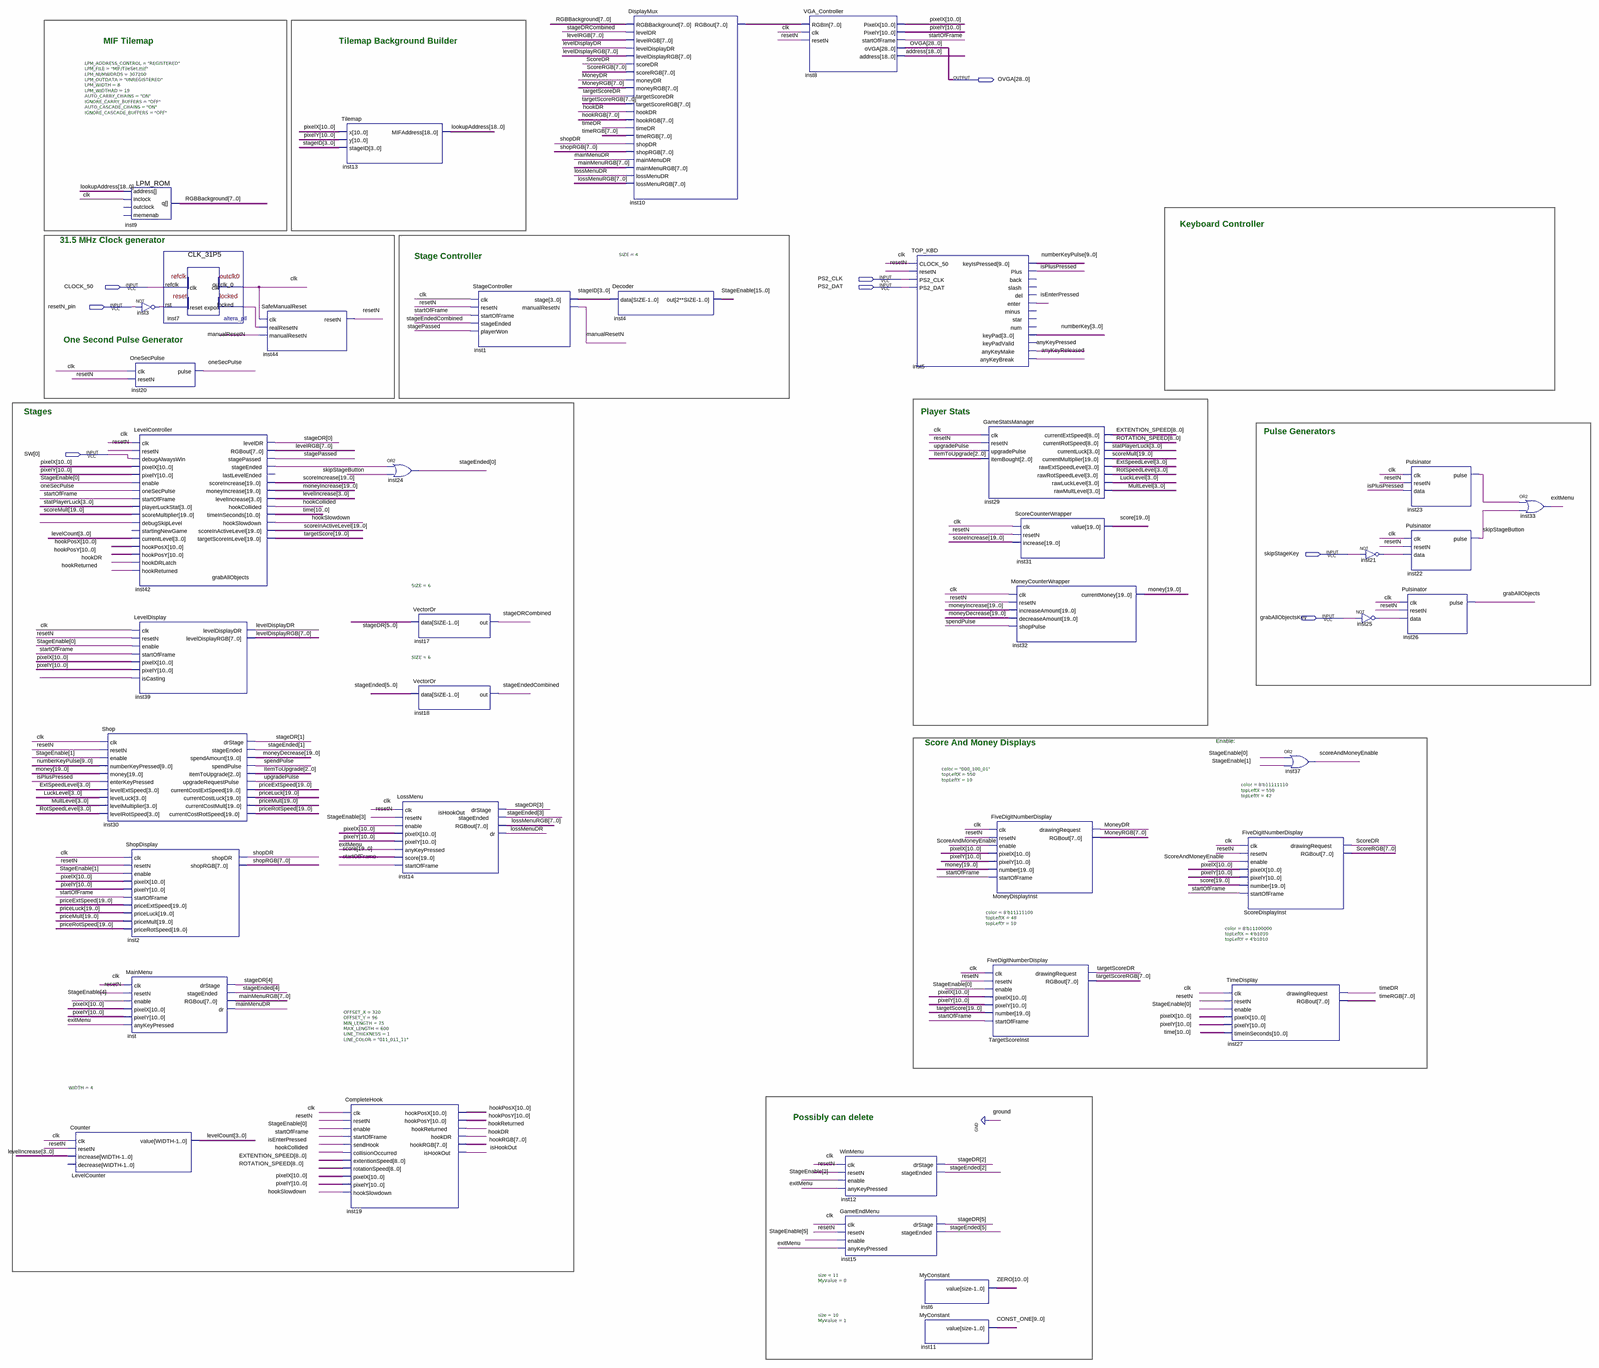
[diagram p0: schematic sheet, whole]
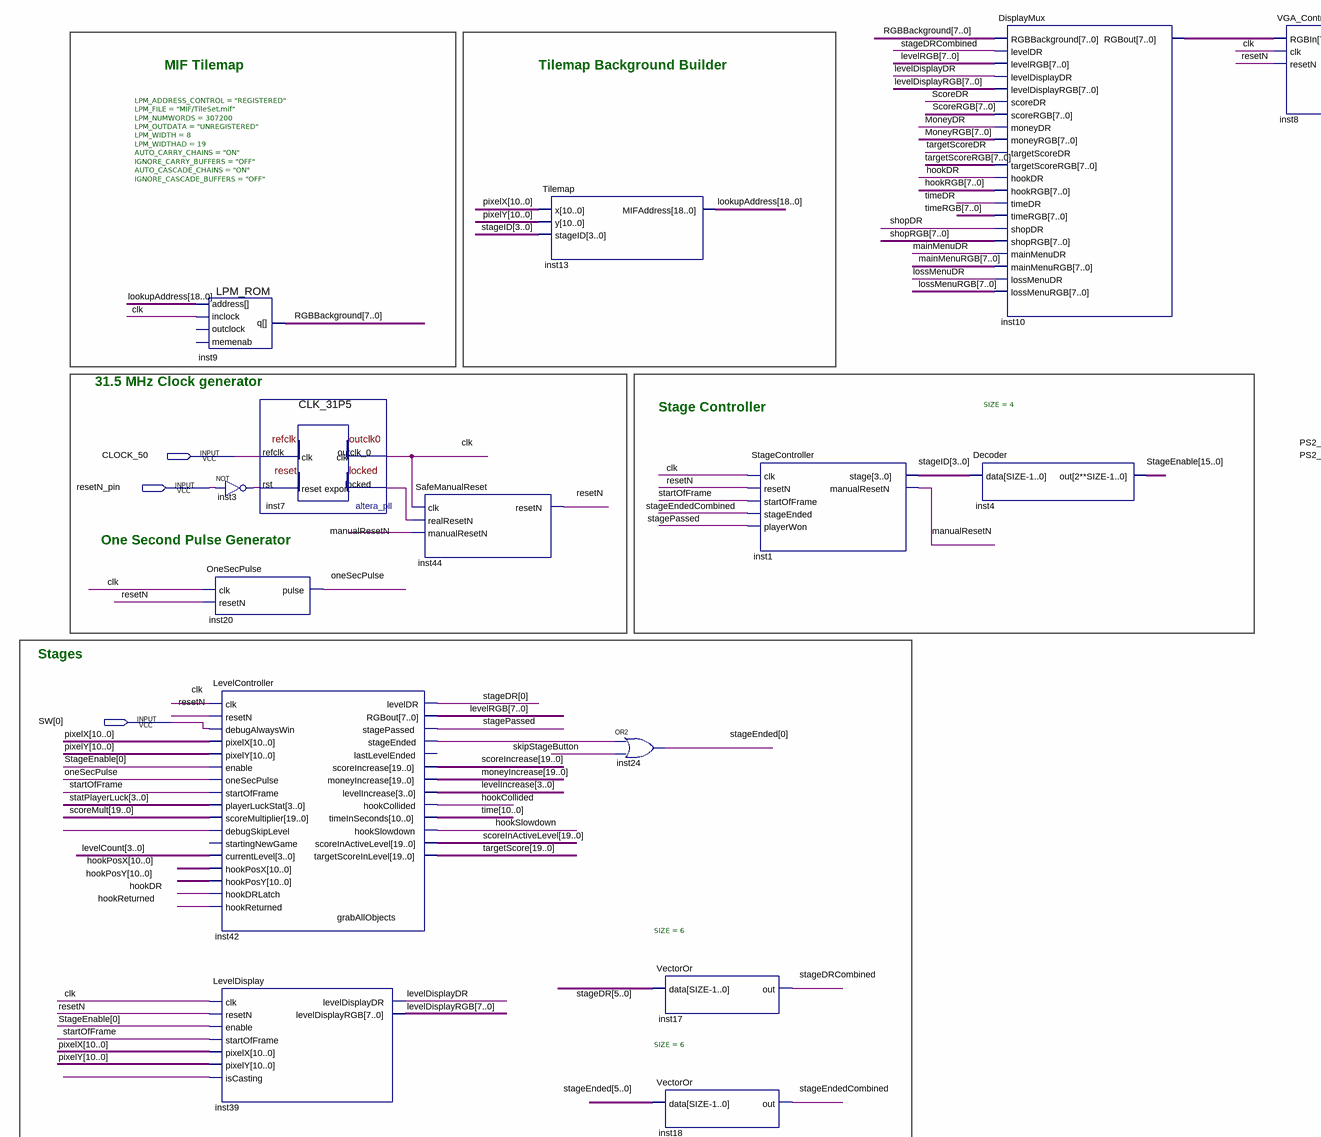
[diagram p1: schematic sheet, upper left part]
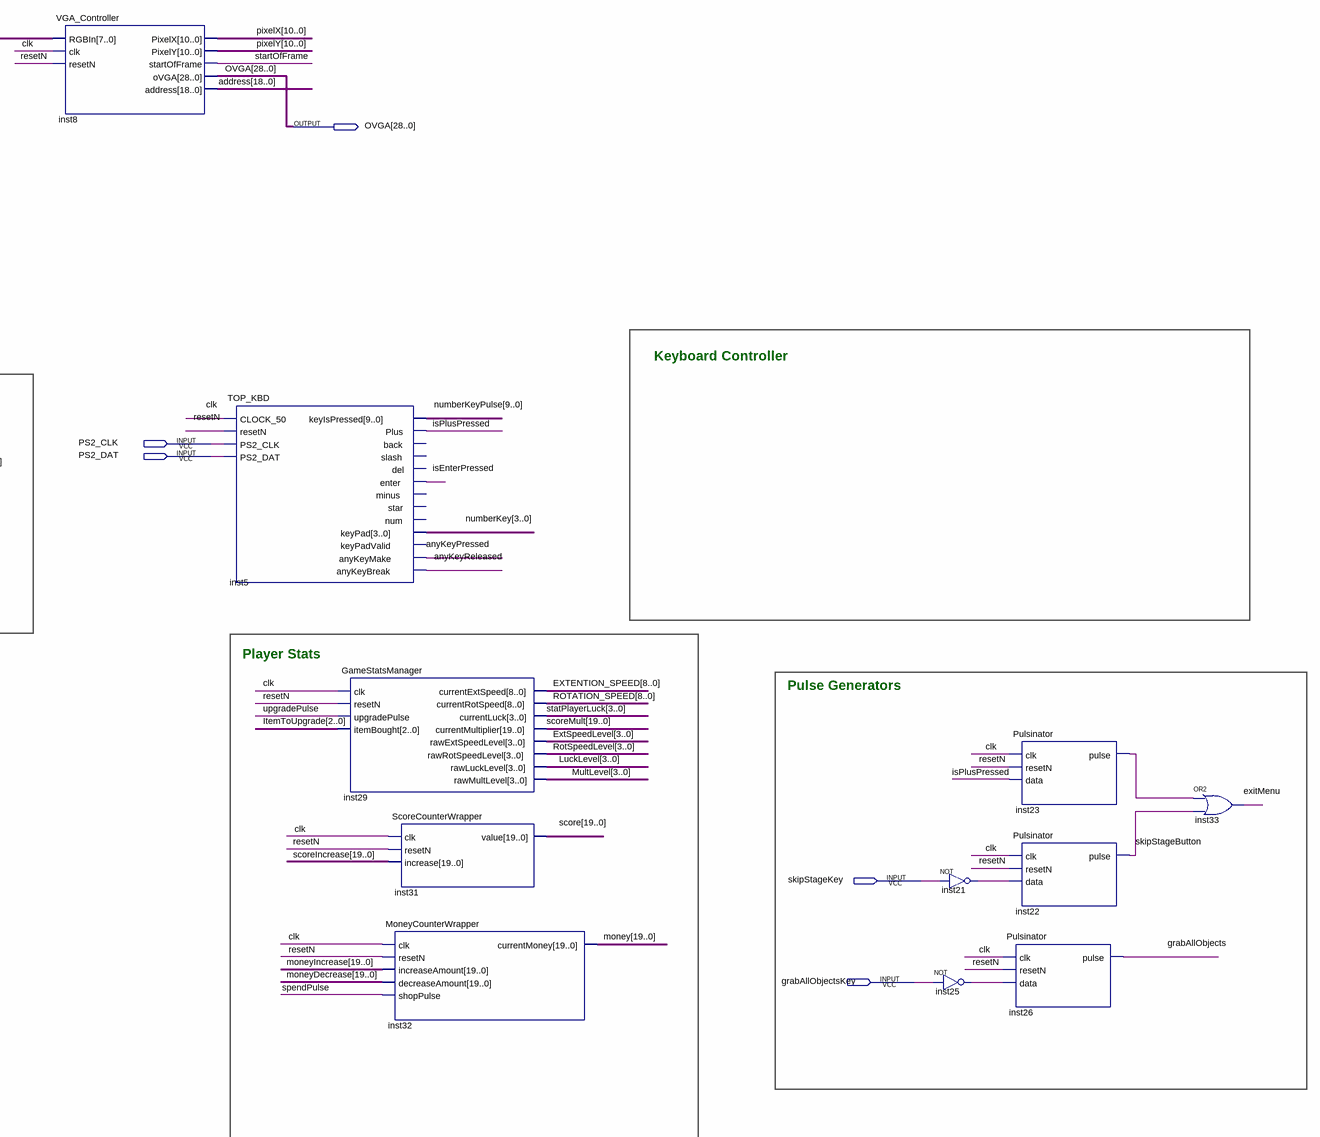
[diagram p2: schematic sheet, upper right part]
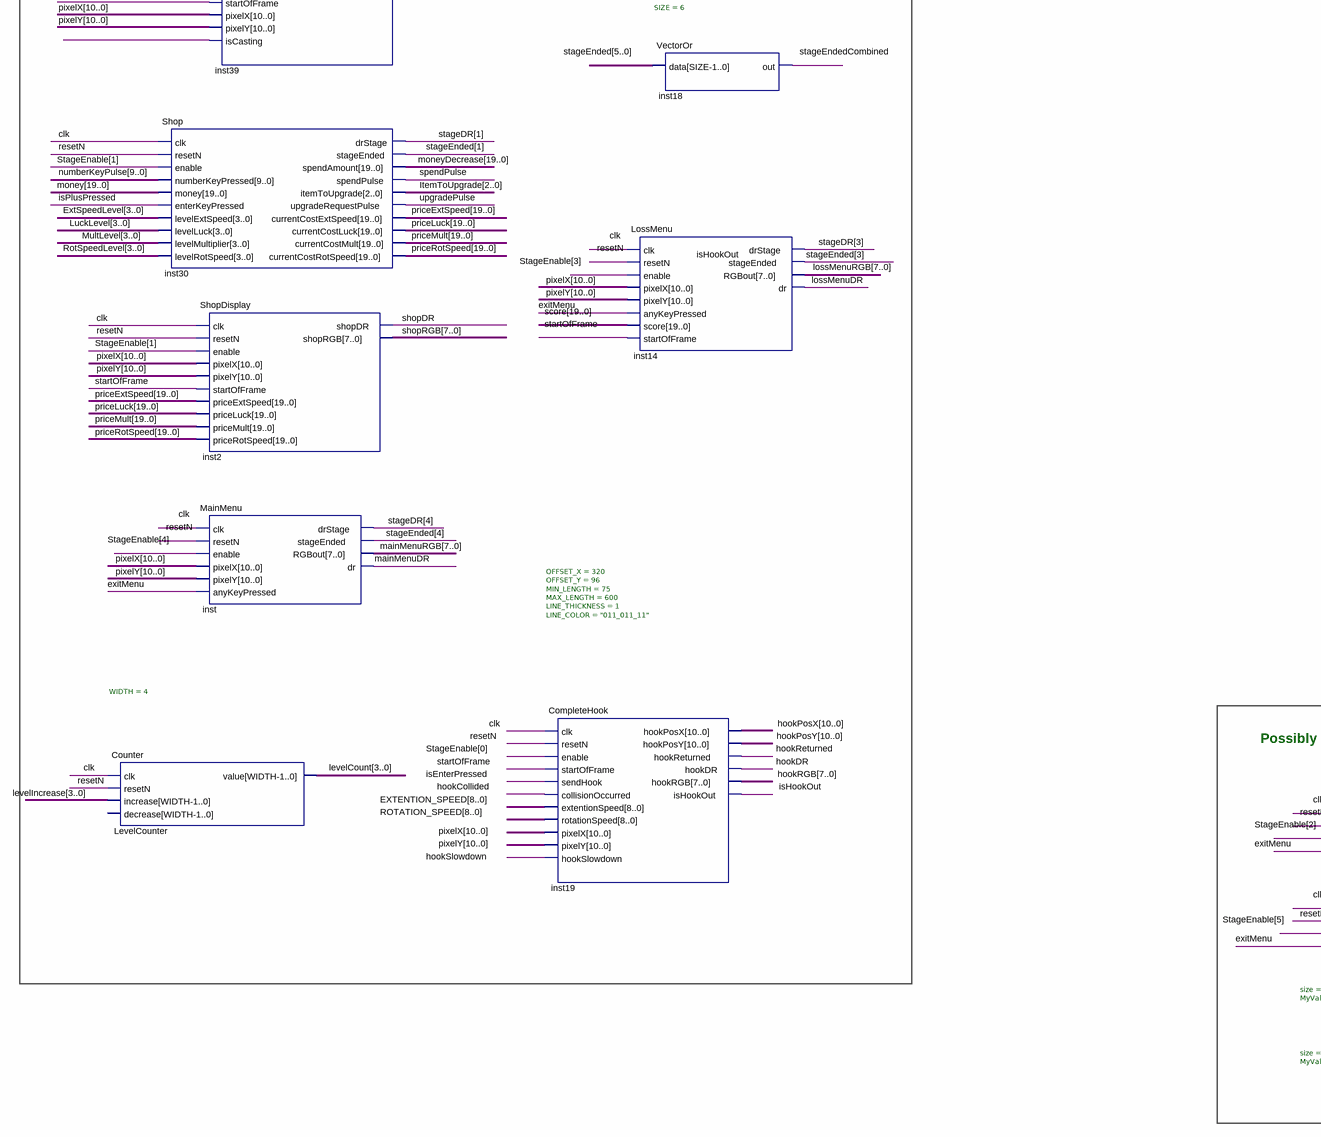
[diagram p3: schematic sheet, lower left part]
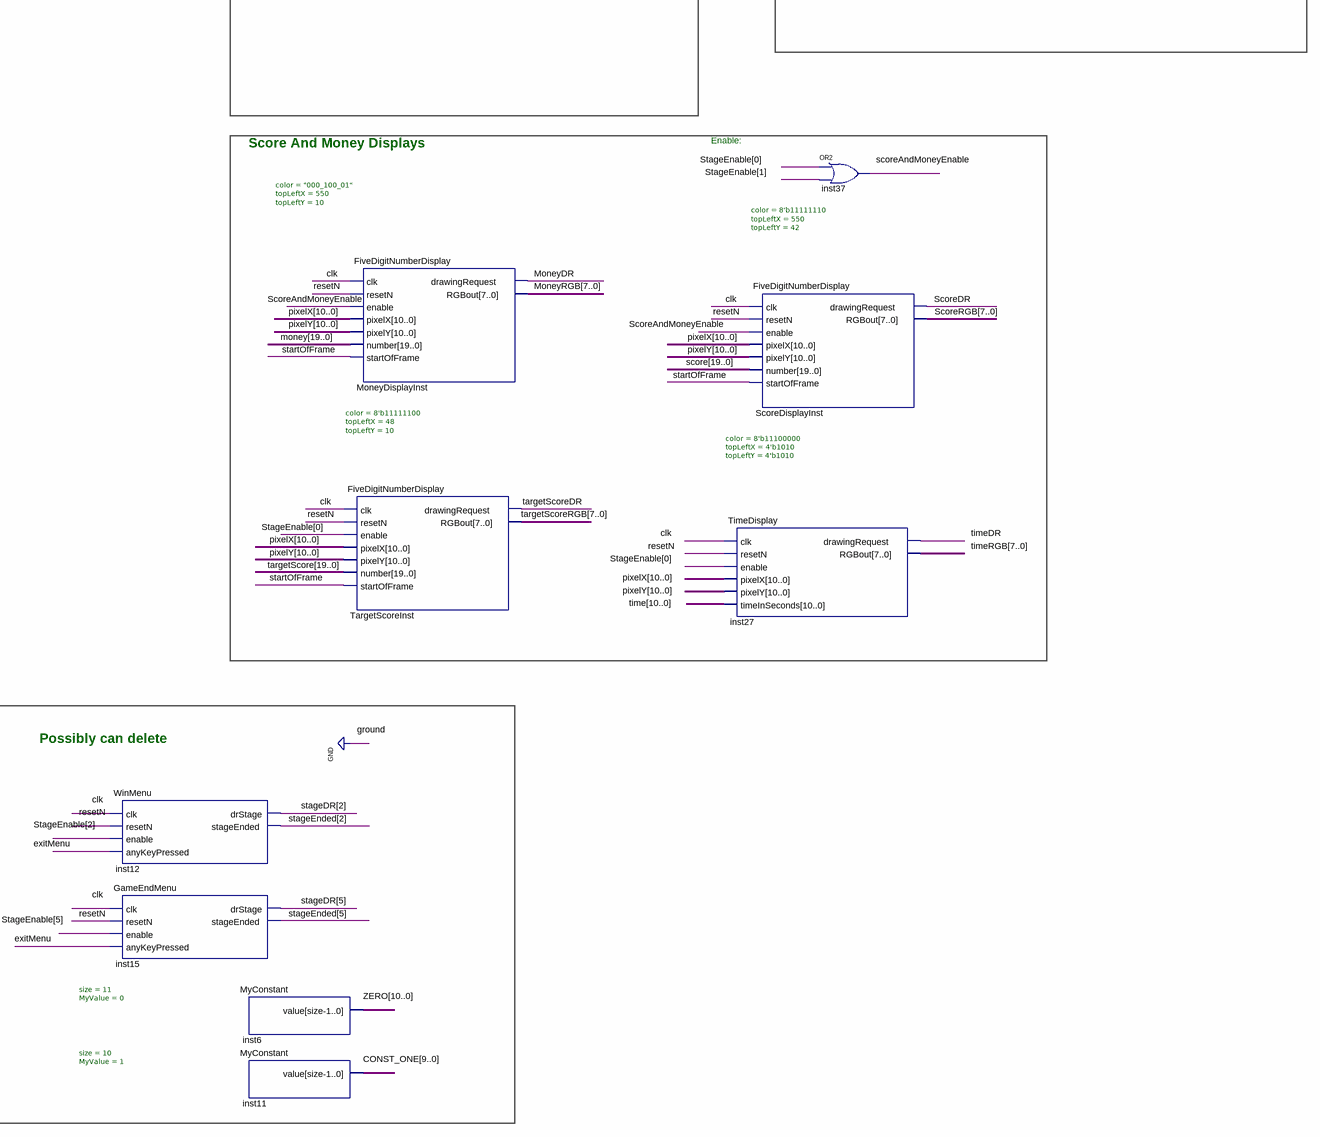
[diagram p4: schematic sheet, lower right part]
// Quartus schematic main.bdf as structural Verilog: 40 symbols, 8 pins
module main (
  input  PS2_CLK,
  input  CLOCK_50,
  input  PS2_DAT,
  input  resetN_pin,
  input  [0:0] SW,
  input  skipStageKey,
  input  grabAllObjectsKey,
  output [28:0] OVGA
);

  wire anyKeyPressed, anyKeyReleased, clk, exitMenu, grabAllObjects, hookCollided, hookDR, hookReturned,
       hookSlowdown, inst3_out, inst7_locked, inst21_out, inst23_pulse, inst25_out, inst42_stageended,
       isEnterPressed, isHookOut, isPlusPressed, levelDisplayDR, lossMenuDR, mainMenuDR, manualResetN,
       MoneyDR, oneSecPulse, resetN, ScoreAndMoneyEnable, ScoreDR, shopDR, skipStageButton, spendPulse,
       stageDRCombined, stageEndedCombined, stagePassed, startOfFrame, targetScoreDR, timeDR, upgradePulse;
  wire [2:0] ItemToUpgrade;
  wire [3:0] ExtSpeedLevel, levelCount, levelIncrease, LuckLevel, MultLevel, numberKey, RotSpeedLevel,
       stageID, statPlayerLuck;
  wire [5:0] stageDR, stageEnded;
  wire [7:0] hookRGB, inst10_rgbout, levelDisplayRGB, levelRGB, lossMenuRGB, mainMenuRGB, MoneyRGB,
       RGBBackground, ScoreRGB, shopRGB, targetScoreRGB, timeRGB;
  wire [8:0] EXTENTION_SPEED, ROTATION_SPEED;
  wire [9:0] CONST_ONE, numberKeyPulse;
  wire [10:0] hookPosX, hookPosY, pixelX, pixelY, \time , ZERO;
  wire [15:0] StageEnable;
  wire [18:0] address, lookupAddress;
  wire [19:0] money, moneyDecrease, moneyIncrease, priceExtSpeed, priceLuck, priceMult, priceRotSpeed, score,
       scoreInActiveLevel, scoreIncrease, scoreMult, targetScore;

  Counter #(.WIDTH(4)) LevelCounter (
    .clk(clk), .resetN(resetN), .increase(levelIncrease), .value(levelCount));  // open: decrease
  Shop inst30 (
    .clk(clk), .resetN(resetN), .enable(StageEnable[1]), .numberKeyPressed(numberKeyPulse), .money(money),
    .enterKeyPressed(isPlusPressed), .levelExtSpeed(ExtSpeedLevel), .levelLuck(LuckLevel),
    .levelMultiplier(MultLevel), .levelRotSpeed(RotSpeedLevel), .drStage(stageDR[1]),
    .stageEnded(stageEnded[1]), .spendAmount(moneyDecrease), .spendPulse(spendPulse),
    .itemToUpgrade(ItemToUpgrade), .upgradeRequestPulse(upgradePulse), .currentCostExtSpeed(priceExtSpeed),
    .currentCostLuck(priceLuck), .currentCostMult(priceMult), .currentCostRotSpeed(priceRotSpeed));
  LPM_ROM #(.LPM_ADDRESS_CONTROL("REGISTERED"), .LPM_FILE("MIF/TileSet.mif"), .LPM_NUMWORDS(307200), .LPM_OUTDATA("UNREGISTERED"), .LPM_WIDTH(8), .LPM_WIDTHAD(19), .AUTO_CARRY_CHAINS("ON"), .IGNORE_CARRY_BUFFERS("OFF"), .AUTO_CASCADE_CHAINS("ON"), .IGNORE_CASCADE_BUFFERS("OFF")) inst9 (
    .address(lookupAddress), .inclock(clk), .q(RGBBackground));  // open: outclock, memenab
  OneSecPulse inst20 (.clk(clk), .resetN(resetN), .pulse(oneSecPulse));
  LevelController inst42 (
    .clk(clk), .resetN(resetN), .debugAlwaysWin(SW[0]), .pixelX(pixelX), .pixelY(pixelY),
    .enable(StageEnable[0]), .oneSecPulse(oneSecPulse), .startOfFrame(startOfFrame),
    .playerLuckStat(statPlayerLuck), .scoreMultiplier(scoreMult), .debugSkipLevel(grabAllObjects),
    .currentLevel(levelCount), .hookPosX(hookPosX), .hookPosY(hookPosY), .hookDRLatch(hookDR),
    .hookReturned(hookReturned), .levelDR(stageDR[0]), .RGBout(levelRGB), .stagePassed(stagePassed),
    .stageEnded(inst42_stageended), .scoreIncrease(scoreIncrease), .moneyIncrease(moneyIncrease),
    .levelIncrease(levelIncrease), .hookCollided(hookCollided), .timeInSeconds(\time ),
    .hookSlowdown(hookSlowdown), .scoreInActiveLevel(scoreInActiveLevel), .targetScoreInLevel(targetScore));  // open: startingNewGame, lastLevelEnded
  LevelDisplay inst39 (
    .clk(clk), .resetN(resetN), .enable(StageEnable[0]), .startOfFrame(startOfFrame), .pixelX(pixelX),
    .pixelY(pixelY), .isCasting(isHookOut), .levelDisplayDR(levelDisplayDR), .levelDisplayRGB(levelDisplayRGB));
  ShopDisplay inst2 (
    .clk(clk), .resetN(resetN), .enable(StageEnable[1]), .pixelX(pixelX), .pixelY(pixelY),
    .startOfFrame(startOfFrame), .priceExtSpeed(priceExtSpeed), .priceLuck(priceLuck), .priceMult(priceMult),
    .priceRotSpeed(priceRotSpeed), .shopDR(shopDR), .shopRGB(shopRGB));
  MainMenu inst (
    .clk(clk), .resetN(resetN), .enable(StageEnable[4]), .pixelX(pixelX), .pixelY(pixelY),
    .anyKeyPressed(exitMenu), .drStage(stageDR[4]), .stageEnded(stageEnded[4]), .RGBout(mainMenuRGB),
    .dr(mainMenuDR));
  CLK_31P5 inst7 (.refclk(CLOCK_50), .rst(inst3_out), .outclk_0(clk), .locked(inst7_locked));
  not inst3 (inst3_out, resetN_pin);
  SafeManualReset inst44 (.clk(clk), .realResetN(inst7_locked), .manualResetN(manualResetN), .resetN(resetN));
  Tilemap inst13 (.x(pixelX), .y(pixelY), .stageID(stageID), .MIFAddress(lookupAddress));
  CompleteHook #(.OFFSET_X(320), .OFFSET_Y(96), .MIN_LENGTH(75), .MAX_LENGTH(600), .LINE_THICKNESS(1), .LINE_COLOR("011_011_11")) inst19 (
    .clk(clk), .resetN(resetN), .enable(StageEnable[0]), .startOfFrame(startOfFrame),
    .sendHook(isEnterPressed), .collisionOccurred(hookCollided), .extentionSpeed(EXTENTION_SPEED),
    .rotationSpeed(ROTATION_SPEED), .pixelX(pixelX), .pixelY(pixelY), .hookSlowdown(hookSlowdown),
    .hookPosX(hookPosX), .hookPosY(hookPosY), .hookReturned(hookReturned), .hookDR(hookDR),
    .hookRGB(hookRGB), .isHookOut(isHookOut));
  or inst24 (stageEnded[0], inst42_stageended, skipStageButton);
  VectorOr #(.SIZE(6)) inst17 (.data(stageDR), .out(stageDRCombined));
  VectorOr #(.SIZE(6)) inst18 (.data(stageEnded), .out(stageEndedCombined));
  LossMenu inst14 (
    .clk(clk), .resetN(resetN), .enable(StageEnable[3]), .pixelX(pixelX), .pixelY(pixelY),
    .anyKeyPressed(exitMenu), .score(score), .startOfFrame(startOfFrame), .drStage(stageDR[3]),
    .stageEnded(stageEnded[3]), .RGBout(lossMenuRGB), .dr(lossMenuDR));
  StageController inst1 (
    .clk(clk), .resetN(resetN), .startOfFrame(startOfFrame), .stageEnded(stageEndedCombined),
    .playerWon(stagePassed), .stage(stageID), .manualResetN(manualResetN));
  Decoder #(.SIZE(4)) inst4 (.data(stageID), .out(StageEnable));
  DisplayMux inst10 (
    .RGBBackground(RGBBackground), .levelDR(stageDRCombined), .levelRGB(levelRGB),
    .levelDisplayDR(levelDisplayDR), .levelDisplayRGB(levelDisplayRGB), .scoreDR(ScoreDR),
    .scoreRGB(ScoreRGB), .moneyDR(MoneyDR), .moneyRGB(MoneyRGB), .targetScoreDR(targetScoreDR),
    .targetScoreRGB(targetScoreRGB), .hookDR(hookDR), .hookRGB(hookRGB), .timeDR(timeDR), .timeRGB(timeRGB),
    .shopDR(shopDR), .shopRGB(shopRGB), .mainMenuDR(mainMenuDR), .mainMenuRGB(mainMenuRGB),
    .lossMenuDR(lossMenuDR), .lossMenuRGB(lossMenuRGB), .RGBout(inst10_rgbout));
  VGA_Controller inst8 (
    .RGBIn(inst10_rgbout), .clk(clk), .resetN(resetN), .PixelX(pixelX), .PixelY(pixelY),
    .startOfFrame(startOfFrame), .oVGA(OVGA), .address(address));
  WinMenu inst12 (
    .clk(clk), .resetN(resetN), .enable(StageEnable[2]), .anyKeyPressed(exitMenu), .drStage(stageDR[2]),
    .stageEnded(stageEnded[2]));
  GameEndMenu inst15 (
    .clk(clk), .resetN(resetN), .enable(StageEnable[5]), .anyKeyPressed(exitMenu), .drStage(stageDR[5]),
    .stageEnded(stageEnded[5]));
  TOP_KBD inst5 (
    .CLOCK_50(clk), .resetN(resetN), .PS2_CLK(PS2_CLK), .PS2_DAT(PS2_DAT), .keyIsPressed(numberKeyPulse),
    .Plus(isPlusPressed), .enter(isEnterPressed), .keyPad(numberKey), .anyKeyMake(anyKeyPressed),
    .anyKeyBreak(anyKeyReleased));  // open: back, slash, del, minus, star, num, keyPadValid
  MyConstant #(.size(11), .MyValue(0)) inst6 (.value(ZERO));
  MyConstant #(.size(10), .MyValue(1)) inst11 (.value(CONST_ONE));
  GameStatsManager inst29 (
    .clk(clk), .resetN(resetN), .upgradePulse(upgradePulse), .itemBought(ItemToUpgrade),
    .currentExtSpeed(EXTENTION_SPEED), .currentRotSpeed(ROTATION_SPEED), .currentLuck(statPlayerLuck),
    .currentMultiplier(scoreMult), .rawExtSpeedLevel(ExtSpeedLevel), .rawRotSpeedLevel(RotSpeedLevel),
    .rawLuckLevel(LuckLevel), .rawMultLevel(MultLevel));
  FiveDigitNumberDisplay #(.color("000_100_01"), .topLeftX(550), .topLeftY(10)) MoneyDisplayInst (
    .clk(clk), .resetN(resetN), .enable(ScoreAndMoneyEnable), .pixelX(pixelX), .pixelY(pixelY),
    .number(money), .startOfFrame(startOfFrame), .drawingRequest(MoneyDR), .RGBout(MoneyRGB));
  FiveDigitNumberDisplay #(.color(8'b11111100), .topLeftX(48), .topLeftY(10)) TargetScoreInst (
    .clk(clk), .resetN(resetN), .enable(StageEnable[0]), .pixelX(pixelX), .pixelY(pixelY),
    .number(targetScore), .startOfFrame(startOfFrame), .drawingRequest(targetScoreDR), .RGBout(targetScoreRGB));
  ScoreCounterWrapper inst31 (.clk(clk), .resetN(resetN), .increase(scoreIncrease), .value(score));
  MoneyCounterWrapper inst32 (
    .clk(clk), .resetN(resetN), .increaseAmount(moneyIncrease), .decreaseAmount(moneyDecrease),
    .shopPulse(spendPulse), .currentMoney(money));
  FiveDigitNumberDisplay #(.color(8'b11111110), .topLeftX(550), .topLeftY(42)) ScoreDisplayInst (
    .clk(clk), .resetN(resetN), .enable(ScoreAndMoneyEnable), .pixelX(pixelX), .pixelY(pixelY),
    .number(score), .startOfFrame(startOfFrame), .drawingRequest(ScoreDR), .RGBout(ScoreRGB));
  TimeDisplay #(.color(8'b11100000), .topLeftX(4'b1010), .topLeftY(4'b1010)) inst27 (
    .clk(clk), .resetN(resetN), .enable(StageEnable[0]), .pixelX(pixelX), .pixelY(pixelY),
    .timeInSeconds(\time ), .drawingRequest(timeDR), .RGBout(timeRGB));
  or inst37 (ScoreAndMoneyEnable, StageEnable[0], StageEnable[1]);
  not inst21 (inst21_out, skipStageKey);
  not inst25 (inst25_out, grabAllObjectsKey);
  Pulsinator inst23 (.clk(clk), .resetN(resetN), .data(isPlusPressed), .pulse(inst23_pulse));
  Pulsinator inst22 (.clk(clk), .resetN(resetN), .data(inst21_out), .pulse(skipStageButton));
  Pulsinator inst26 (.clk(clk), .resetN(resetN), .data(inst25_out), .pulse(grabAllObjects));
  or inst33 (exitMenu, inst23_pulse, skipStageButton);

  // Notes on the sheet:
  //   MIF Tilemap
  //   Tilemap Background Builder
  //   Keyboard Controller
  //   31.5 MHz Clock generator
  //   Stage Controller
  //   One Second Pulse Generator
  //   Stages
  //   Player Stats
  //   Pulse Generators
  //   Score And Money Displays
  //   Enable:
  //   Possibly can delete
endmodule
